# Altium schematic sheet PATHOS_FPGA_IO_Ext.SchDoc
size A3; CompanyName: NTB; Organization: NTB Interstate University of Applied; Address1: Werdenbergstrasse 4; Address3: 9471 Buchs; Address4: Switzerland; Organization1: Sciences of Technology Buchs; Size: A3
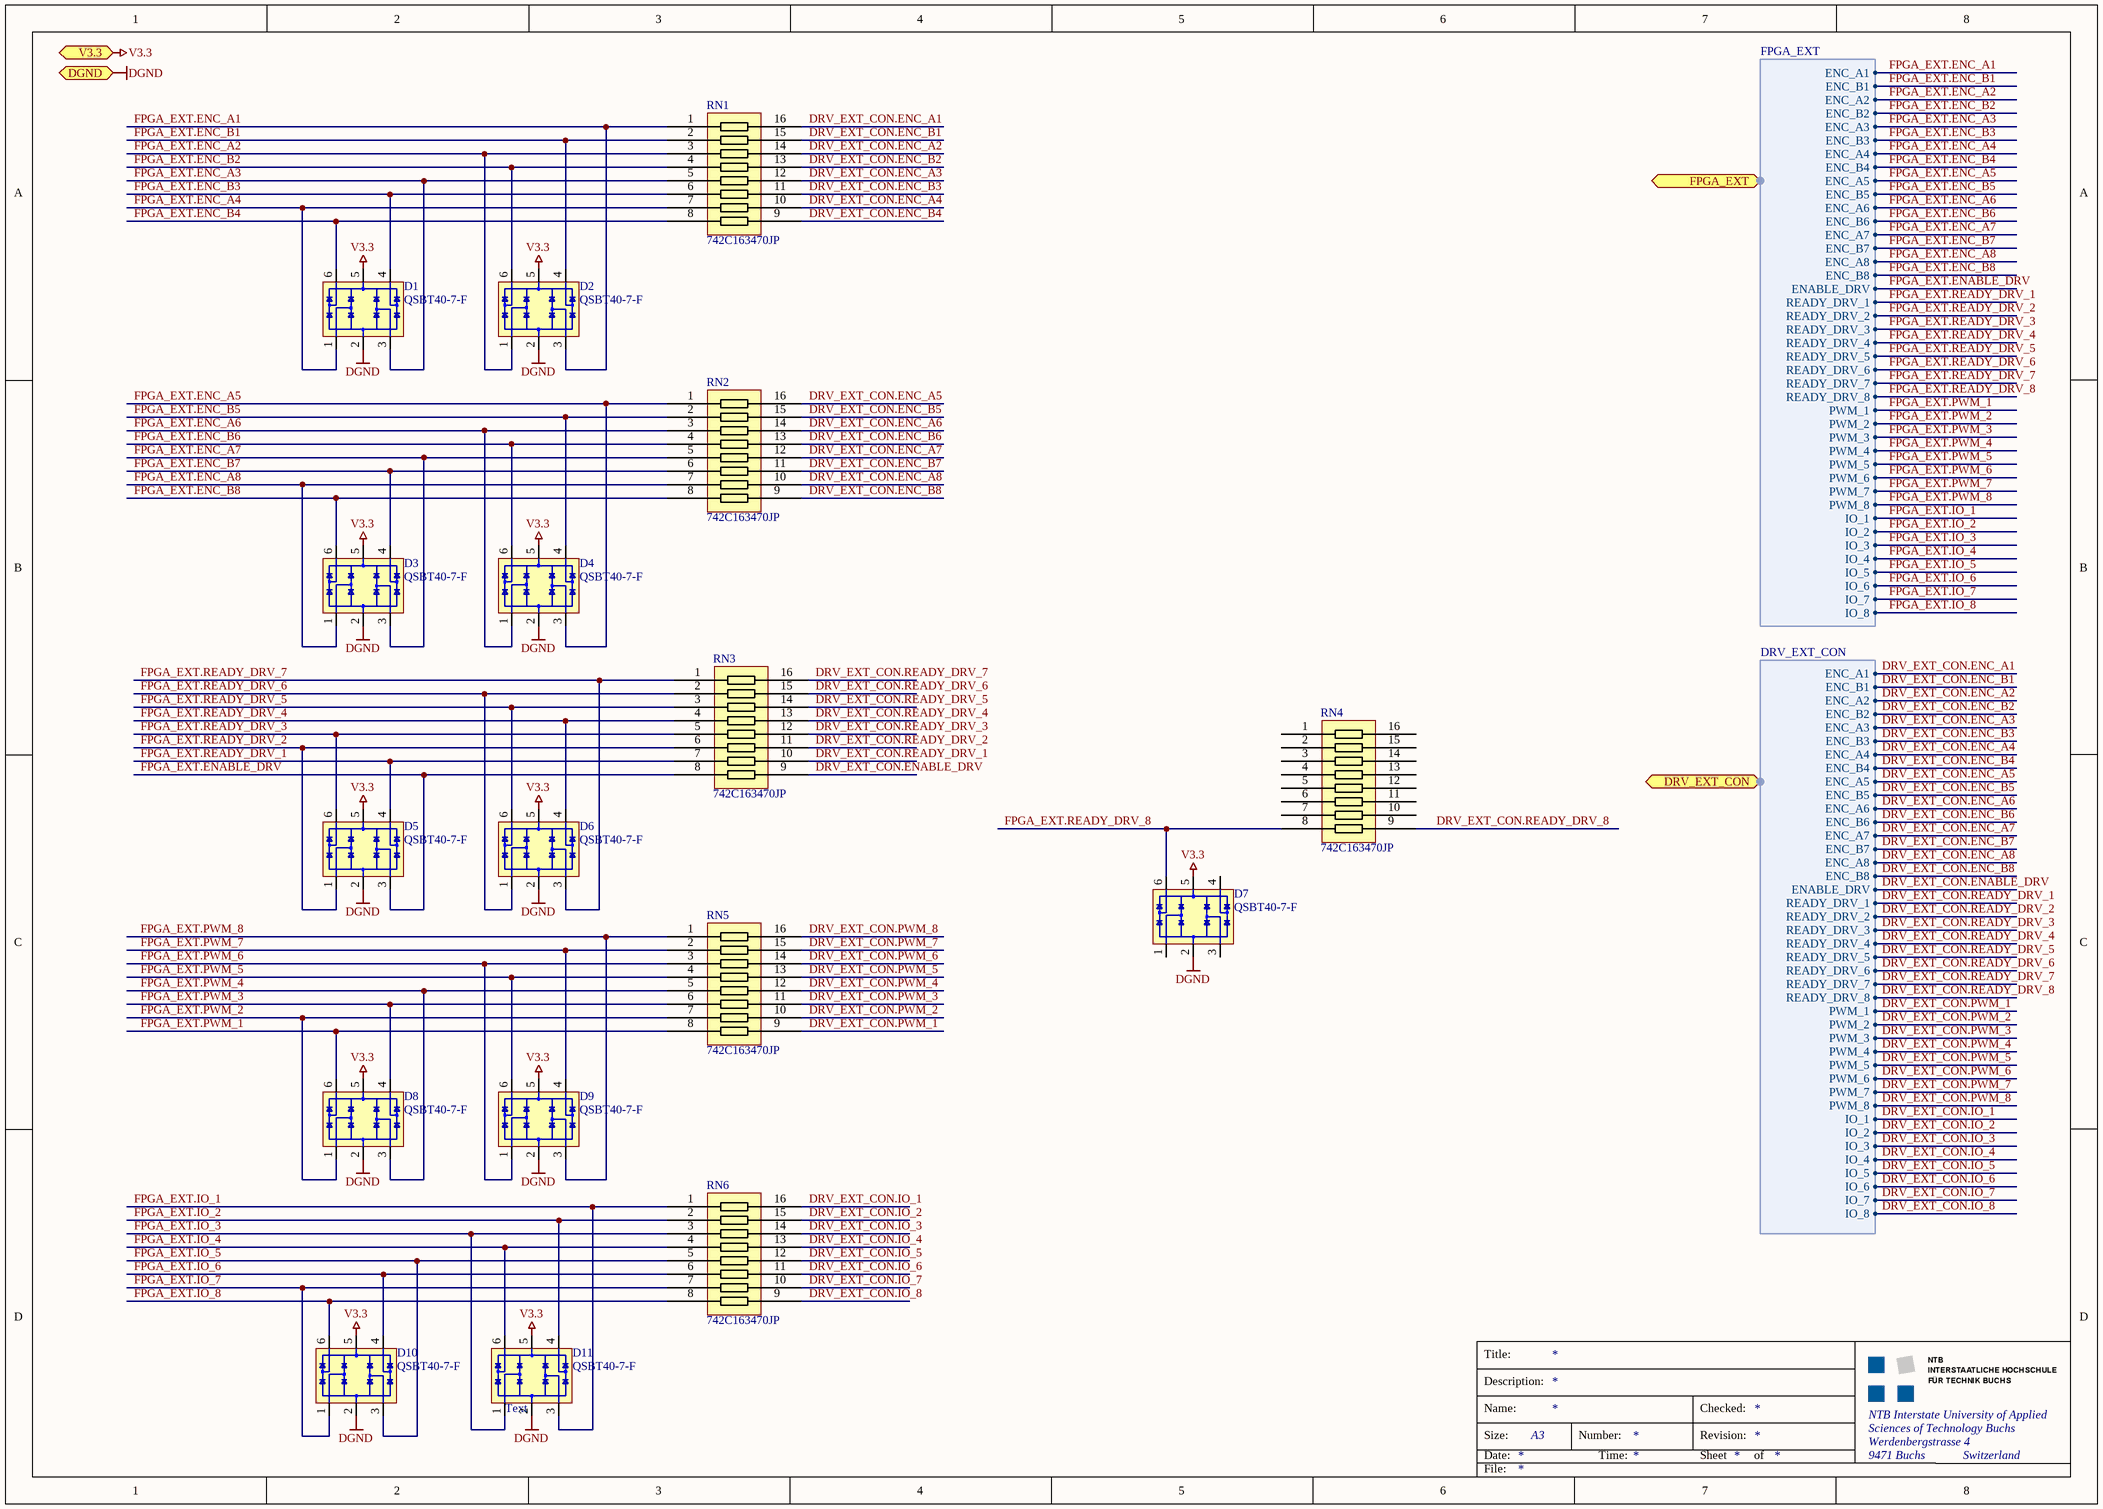
[diagram p0: PATHOS_FPGA_IO_Ext.SchDoc]

## Parts
D1  QSBT40-7-F  [SOT363]
D2  QSBT40-7-F  [SOT363]
D3  QSBT40-7-F  [SOT363]
D4  QSBT40-7-F  [SOT363]
D5  QSBT40-7-F  [SOT363]
D6  QSBT40-7-F  [SOT363]
D7  QSBT40-7-F  [SOT363]
D8  QSBT40-7-F  [SOT363]
D9  QSBT40-7-F  [SOT363]
D10  QSBT40-7-F  [SOT363]
D11  QSBT40-7-F  [SOT363]
RN1  742C163470JP  [742C163470JP]
RN2  742C163470JP  [742C163470JP]
RN3  742C163470JP  [742C163470JP]
RN4  742C163470JP  [742C163470JP]
RN5  742C163470JP  [742C163470JP]
RN6  742C163470JP  [742C163470JP]

## Ports
DGND, DRV_EXT_CON (harness DRV_EXT_CON), FPGA_EXT (harness FPGA_EXT), V3.3

## Harnesses
DRV_EXT_CON: ENC_A1, ENC_B1, ENC_A2, ENC_B2, ENC_A3, ENC_B3, ENC_A4, ENC_B4, ENC_A5, ENC_B5, ENC_A6, ENC_B6, ENC_A7, ENC_B7, ENC_A8, ENC_B8, PWM_1, ENABLE_DRV, READY_DRV_4, READY_DRV_3, READY_DRV_2, READY_DRV_1, IO_1, IO_2, READY_DRV_5, READY_DRV_6, READY_DRV_7, READY_DRV_8, PWM_2, PWM_3, PWM_4, PWM_5, PWM_6, PWM_7, PWM_8, IO_3, IO_4, IO_5, IO_6, IO_7, IO_8
FPGA_EXT: ENC_A1, ENC_B1, ENC_A2, ENC_B2, ENC_A3, ENC_B3, ENC_A4, ENC_B4, PWM_1, ENABLE_DRV, READY_DRV_4, READY_DRV_3, READY_DRV_2, READY_DRV_1, IO_1, IO_2, ENC_A5, ENC_B5, ENC_A6, ENC_B6, ENC_A7, ENC_B7, ENC_A8, ENC_B8, READY_DRV_5, READY_DRV_6, READY_DRV_7, READY_DRV_8, PWM_2, PWM_3, PWM_4, PWM_5, PWM_6, PWM_7, PWM_8, IO_3, IO_4, IO_5, IO_6, IO_7, IO_8

## Nets
DGND: D1.2 D2.2 D3.2 D4.2 D5.2 D6.2 D7.2 D8.2 D9.2 D10.2 D11.2 ; port DGND
V3.3: D1.5 D2.5 D3.5 D4.5 D5.5 D6.5 D7.5 D8.5 D9.5 D10.5 D11.5 ; port V3.3
DRV_EXT_CON.ENABLE_DRV: RN3.9 ; port DRV_EXT_CON.ENABLE_DRV
DRV_EXT_CON.ENC_A1: RN1.16 ; port DRV_EXT_CON.ENC_A1
DRV_EXT_CON.ENC_A2: RN1.14 ; port DRV_EXT_CON.ENC_A2
DRV_EXT_CON.ENC_A3: RN1.12 ; port DRV_EXT_CON.ENC_A3
DRV_EXT_CON.ENC_A4: RN1.10 ; port DRV_EXT_CON.ENC_A4
DRV_EXT_CON.ENC_A5: RN2.16 ; port DRV_EXT_CON.ENC_A5
DRV_EXT_CON.ENC_A6: RN2.14 ; port DRV_EXT_CON.ENC_A6
DRV_EXT_CON.ENC_A7: RN2.12 ; port DRV_EXT_CON.ENC_A7
DRV_EXT_CON.ENC_A8: RN2.10 ; port DRV_EXT_CON.ENC_A8
DRV_EXT_CON.ENC_B1: RN1.15 ; port DRV_EXT_CON.ENC_B1
DRV_EXT_CON.ENC_B2: RN1.13 ; port DRV_EXT_CON.ENC_B2
DRV_EXT_CON.ENC_B3: RN1.11 ; port DRV_EXT_CON.ENC_B3
DRV_EXT_CON.ENC_B4: RN1.9 ; port DRV_EXT_CON.ENC_B4
DRV_EXT_CON.ENC_B5: RN2.15 ; port DRV_EXT_CON.ENC_B5
DRV_EXT_CON.ENC_B6: RN2.13 ; port DRV_EXT_CON.ENC_B6
DRV_EXT_CON.ENC_B7: RN2.11 ; port DRV_EXT_CON.ENC_B7
DRV_EXT_CON.ENC_B8: RN2.9 ; port DRV_EXT_CON.ENC_B8
DRV_EXT_CON.IO_1: RN6.16 ; port DRV_EXT_CON.IO_1
DRV_EXT_CON.IO_2: RN6.15 ; port DRV_EXT_CON.IO_2
DRV_EXT_CON.IO_3: RN6.14 ; port DRV_EXT_CON.IO_3
DRV_EXT_CON.IO_4: RN6.13 ; port DRV_EXT_CON.IO_4
DRV_EXT_CON.IO_5: RN6.12 ; port DRV_EXT_CON.IO_5
DRV_EXT_CON.IO_6: RN6.11 ; port DRV_EXT_CON.IO_6
DRV_EXT_CON.IO_7: RN6.10 ; port DRV_EXT_CON.IO_7
DRV_EXT_CON.IO_8: RN6.9 ; port DRV_EXT_CON.IO_8
DRV_EXT_CON.PWM_1: RN5.9 ; port DRV_EXT_CON.PWM_1
DRV_EXT_CON.PWM_2: RN5.10 ; port DRV_EXT_CON.PWM_2
DRV_EXT_CON.PWM_3: RN5.11 ; port DRV_EXT_CON.PWM_3
DRV_EXT_CON.PWM_4: RN5.12 ; port DRV_EXT_CON.PWM_4
DRV_EXT_CON.PWM_5: RN5.13 ; port DRV_EXT_CON.PWM_5
DRV_EXT_CON.PWM_6: RN5.14 ; port DRV_EXT_CON.PWM_6
DRV_EXT_CON.PWM_7: RN5.15 ; port DRV_EXT_CON.PWM_7
DRV_EXT_CON.PWM_8: RN5.16 ; port DRV_EXT_CON.PWM_8
DRV_EXT_CON.READY_DRV_1: RN3.10 ; port DRV_EXT_CON.READY_DRV_1
DRV_EXT_CON.READY_DRV_2: RN3.11 ; port DRV_EXT_CON.READY_DRV_2
DRV_EXT_CON.READY_DRV_3: RN3.12 ; port DRV_EXT_CON.READY_DRV_3
DRV_EXT_CON.READY_DRV_4: RN3.13 ; port DRV_EXT_CON.READY_DRV_4
DRV_EXT_CON.READY_DRV_5: RN3.14 ; port DRV_EXT_CON.READY_DRV_5
DRV_EXT_CON.READY_DRV_6: RN3.15 ; port DRV_EXT_CON.READY_DRV_6
DRV_EXT_CON.READY_DRV_7: RN3.16 ; port DRV_EXT_CON.READY_DRV_7
DRV_EXT_CON.READY_DRV_8: RN4.9 ; port DRV_EXT_CON.READY_DRV_8
FPGA_EXT.ENABLE_DRV: D5.3 RN3.8 ; port FPGA_EXT.ENABLE_DRV
FPGA_EXT.ENC_A1: D2.3 RN1.1 ; port FPGA_EXT.ENC_A1
FPGA_EXT.ENC_A2: D2.1 RN1.3 ; port FPGA_EXT.ENC_A2
FPGA_EXT.ENC_A3: D1.3 RN1.5 ; port FPGA_EXT.ENC_A3
FPGA_EXT.ENC_A4: D1.1 RN1.7 ; port FPGA_EXT.ENC_A4
FPGA_EXT.ENC_A5: D4.3 RN2.1 ; port FPGA_EXT.ENC_A5
FPGA_EXT.ENC_A6: D4.1 RN2.3 ; port FPGA_EXT.ENC_A6
FPGA_EXT.ENC_A7: D3.3 RN2.5 ; port FPGA_EXT.ENC_A7
FPGA_EXT.ENC_A8: D3.1 RN2.7 ; port FPGA_EXT.ENC_A8
FPGA_EXT.ENC_B1: D2.4 RN1.2 ; port FPGA_EXT.ENC_B1
FPGA_EXT.ENC_B2: D2.6 RN1.4 ; port FPGA_EXT.ENC_B2
FPGA_EXT.ENC_B3: D1.4 RN1.6 ; port FPGA_EXT.ENC_B3
FPGA_EXT.ENC_B4: D1.6 RN1.8 ; port FPGA_EXT.ENC_B4
FPGA_EXT.ENC_B5: D4.4 RN2.2 ; port FPGA_EXT.ENC_B5
FPGA_EXT.ENC_B6: D4.6 RN2.4 ; port FPGA_EXT.ENC_B6
FPGA_EXT.ENC_B7: D3.4 RN2.6 ; port FPGA_EXT.ENC_B7
FPGA_EXT.ENC_B8: D3.6 RN2.8 ; port FPGA_EXT.ENC_B8
FPGA_EXT.IO_1: D11.3 RN6.1 ; port FPGA_EXT.IO_1
FPGA_EXT.IO_2: D11.4 RN6.2 ; port FPGA_EXT.IO_2
FPGA_EXT.IO_3: D11.1 RN6.3 ; port FPGA_EXT.IO_3
FPGA_EXT.IO_4: D11.6 RN6.4 ; port FPGA_EXT.IO_4
FPGA_EXT.IO_5: D10.3 RN6.5 ; port FPGA_EXT.IO_5
FPGA_EXT.IO_6: D10.4 RN6.6 ; port FPGA_EXT.IO_6
FPGA_EXT.IO_7: D10.1 RN6.7 ; port FPGA_EXT.IO_7
FPGA_EXT.IO_8: D10.6 RN6.8 ; port FPGA_EXT.IO_8
FPGA_EXT.PWM_1: D8.6 RN5.8 ; port FPGA_EXT.PWM_1
FPGA_EXT.PWM_2: D8.1 RN5.7 ; port FPGA_EXT.PWM_2
FPGA_EXT.PWM_3: D8.4 RN5.6 ; port FPGA_EXT.PWM_3
FPGA_EXT.PWM_4: D8.3 RN5.5 ; port FPGA_EXT.PWM_4
FPGA_EXT.PWM_5: D9.6 RN5.4 ; port FPGA_EXT.PWM_5
FPGA_EXT.PWM_6: D9.1 RN5.3 ; port FPGA_EXT.PWM_6
FPGA_EXT.PWM_7: D9.4 RN5.2 ; port FPGA_EXT.PWM_7
FPGA_EXT.PWM_8: D9.3 RN5.1 ; port FPGA_EXT.PWM_8
FPGA_EXT.READY_DRV_1: D5.4 RN3.7 ; port FPGA_EXT.READY_DRV_1
FPGA_EXT.READY_DRV_2: D5.1 RN3.6 ; port FPGA_EXT.READY_DRV_2
FPGA_EXT.READY_DRV_3: D5.6 RN3.5 ; port FPGA_EXT.READY_DRV_3
FPGA_EXT.READY_DRV_4: D6.4 RN3.4 ; port FPGA_EXT.READY_DRV_4
FPGA_EXT.READY_DRV_5: D6.6 RN3.3 ; port FPGA_EXT.READY_DRV_5
FPGA_EXT.READY_DRV_6: D6.1 RN3.2 ; port FPGA_EXT.READY_DRV_6
FPGA_EXT.READY_DRV_7: D6.3 RN3.1 ; port FPGA_EXT.READY_DRV_7
FPGA_EXT.READY_DRV_8: D7.6 RN4.8 ; port FPGA_EXT.READY_DRV_8

Not connected (* = marked no-connect by the designer): D7 1 3 4; RN4 1 2 3 4 5 6 7 10 11 12 13 14 15 16

## Notes on the sheet
- (near D11) Text
- Title:
- Description:
- Size:
- Date:
- Name:
- Number:
- Time:
- Revision:
- Sheet
- Checked:
- of
- File: